# EAGLE board qo-100-lnb-controller (EAGLE 9.6.1)
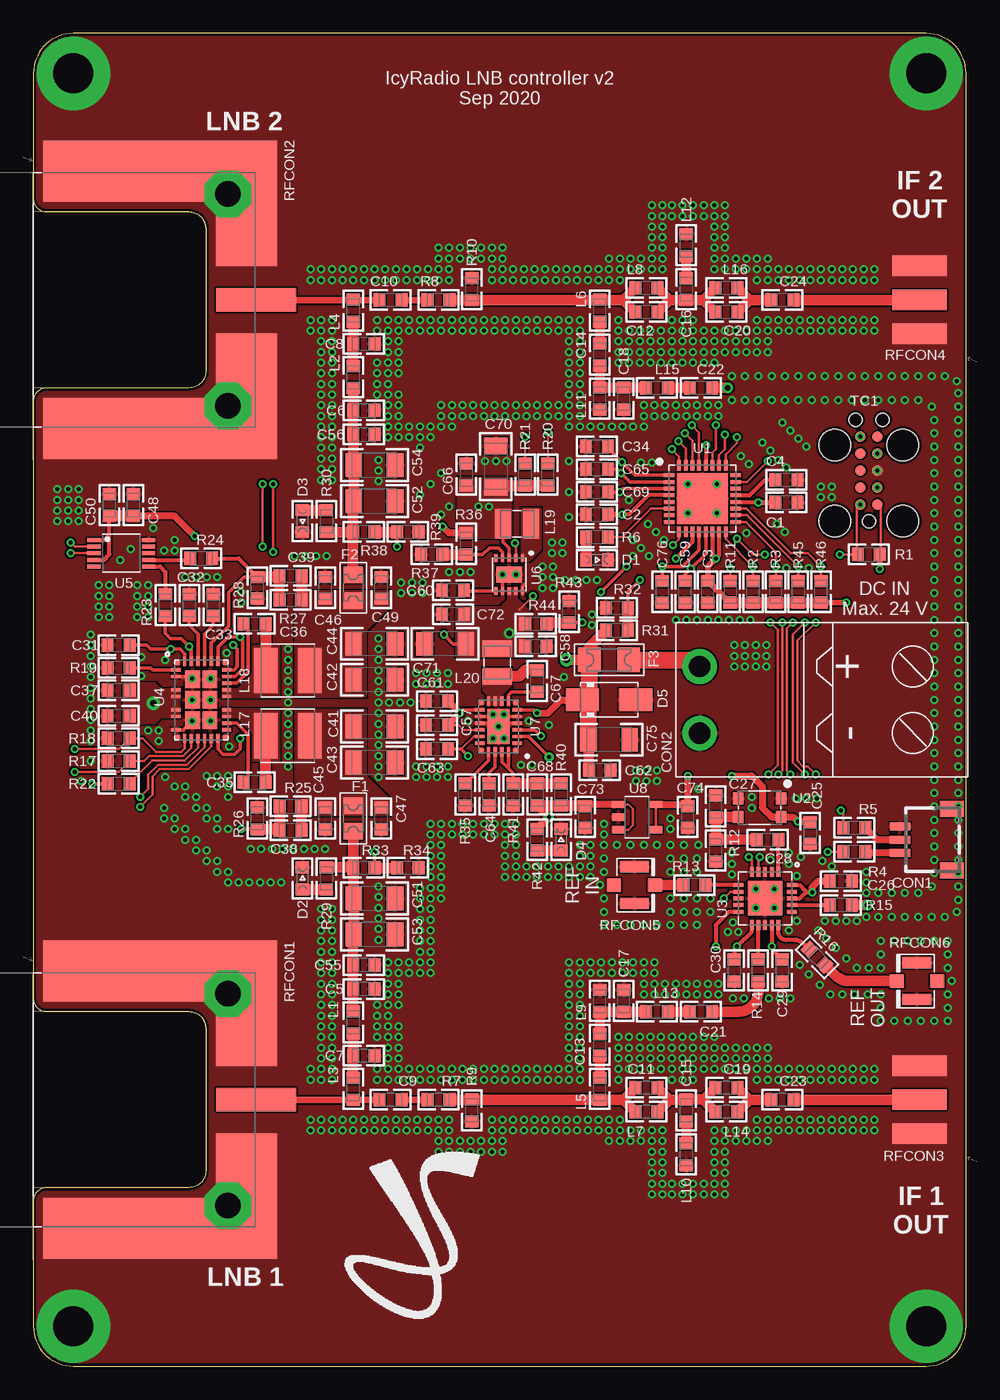
[diagram p10: board, top side]
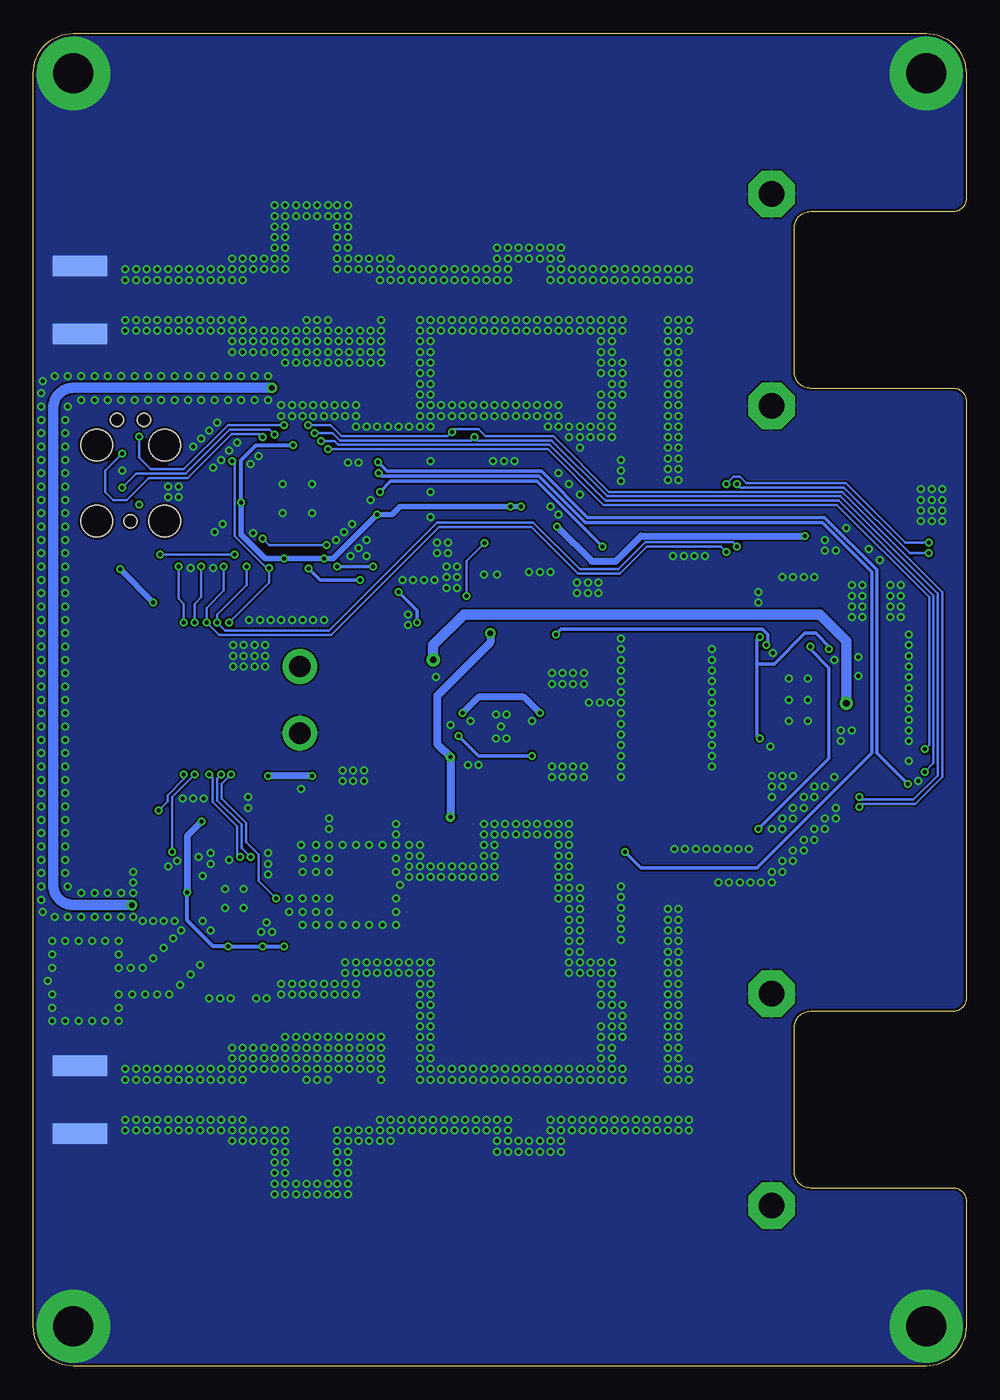
[diagram p11: board, bottom side, seen from below]

Size 70 x 100 mm. Coordinates in mm from the lower left corner, seen from the top.
Outline: 11.68,13.39 1,13.39 arc90 0,12.39 0,3 arc90 3,0 67,0 arc90 70,3 70,97 arc90 67,100 3,100 arc90 0,97 0,87.61 arc90 1,86.61 11.68,86.61 arc-90 12.95,85.33 12.95,74.67 arc-90 11.68,73.39 1,73.39 arc90 0,72.39 0,27.61 arc90 1,26.61 11.68,26.61 arc-90 12.95,25.34 12.95,14.66 arc-90 11.68,13.39
Copper layers (1*16): Top 0.035mm / dielectric 1.6mm / Bottom 0.035mm
Design rules "jlcpcb_2layer": minimum track width 5mil, minimum drill 0.3mm, track to track 5mil, track to pad 5mil, pad to pad 5mil, via to via 5mil, smd to smd 5mil, copper to edge 0.2mm, drill to drill 5mil, minimum pad ring 3mil, minimum via ring 3mil, stop-mask expansion 0.075mm, vias tented up to drill 10mm, thermal gap 5mil
Net classes: 1 75 Ohm: width 0.5 mm, clearance 0.3 mm

## Footprints (pad centres in the part's own frame; a part is rotated, then mirrored left to right if it is on the bottom)
CAP0603 = smd 0.889 x 1.016: 1 -0.819,0; 2 0.819,0
CAP1206 = smd 1.27 x 1.778: 1 -1.549,0; 2 1.549,0
SH-03-SIDE = smd 0.6 x 1.55: 1 -1,2.975; 2 0,2.975; 3 1,2.975 | smd 1.2 x 1.8: FIT@1 -2.3,-0.9; FIT@2 2.3,-0.9
2EDG-2P-5MM = drill 1.6 pad 2.6: P$1 -2.5,0; P$2 2.5,0
0603 = smd 0.889 x 1.016: A 0.819,0; C -0.819,0
DO214AC = smd 2.5 x 1.7: A 2,0; C -2,0
0805 = smd 1.245 x 1.473: 1 -0.965,0; 2 0.965,0
1206 = smd 1.7 x 1.803: 1 -1.472,0; 2 1.472,0
IND0603 = smd 0.889 x 1.016: 1 -0.819,0; 2 0.819,0
IND0404 = smd 1.75 x 3.4: 1 -1.65,0; 2 1.65,0
IND2520 = smd 2.2 x 1.2: 1 0,-1.05; 2 0,1.05
RES0603 = smd 0.889 x 1.016: 1 -0.819,0; 2 0.819,0
F-EDGE = smd 4.575 x 17.53: GND@0 -9.652,9.525; GND@5 9.652,9.525 | drill 1.91 pad 3.5 octagon: GND@1 -7.94,14.61; GND@4 7.94,14.61 | smd 9.4 x 4.58: GND@2 -7.24,16; GND@3 7.24,16 | smd 1.78 x 6: SIGNAL 0,16.71
SMA-EDGE = smd 1.524 x 4.064: GND@0 -2.54,0; GND@1 2.54,0; SIG 0,0 | smd 1.524 x 4.064 bottom: GND@2 -2.54,0; GND@3 2.54,0
U.FL = smd 2.2 x 0.85: P$1 0,1.375; P$2 0,-1.375 | smd 1.05 x 1: P$3 1.525,0; P$4 -1.525,0
TC2050-IDC = smd 0.787 x 0.787: 1 -2.54,-0.635; 2 -1.27,-0.635; 3 0,-0.635; 4 1.27,-0.635; 5 2.54,-0.635; 6 2.54,0.635; 7 1.27,0.635; 8 0,0.635; 9 -1.27,0.635; 10 -2.54,0.635 | hole 0.991: -3.81,0; 3.81,1.016; 3.81,-1.016 | hole 2.375: -3.81,2.54; -3.81,-2.54; 1.905,2.54; 1.905,-2.54
QFN32_0.5P_TG = smd 0.8 x 0.3: 1 -2.5,1.75; 2 -2.5,1.25; 3 -2.5,0.75; 4 -2.5,0.25; 5 -2.5,-0.25; 6 -2.5,-0.75; 7 -2.5,-1.25; 8 -2.5,-1.75; 17 2.5,-1.75; 18 2.5,-1.25; 19 2.5,-0.75; 20 2.5,-0.25; 21 2.5,0.25; 22 2.5,0.75; 23 2.5,1.25; 24 2.5,1.75 | smd 0.3 x 0.8: 9 -1.75,-2.5; 10 -1.25,-2.5; 11 -0.75,-2.5; 12 -0.25,-2.5; 13 0.25,-2.5; 14 0.75,-2.5; 15 1.25,-2.5; 16 1.75,-2.5; 25 1.75,2.5; 26 1.25,2.5; 27 0.75,2.5; 28 0.25,2.5; 29 -0.25,2.5; 30 -0.75,2.5; 31 -1.25,2.5; 32 -1.75,2.5 | smd 3.8 x 3.8: 33 0,0
TCXO-3225 = smd 0.78 x 0.9: 1 -1.6,-0.7; 2 1.6,-0.7; 3 1.6,0.7; 4 -1.6,0.7
QFN20 = smd 0.75 x 0.3: 1 -2,1; 2 -2,0.5; 3 -2,0; 4 -2,-0.5; 5 -2,-1; 11 2,-1; 12 2,-0.5; 13 2,0; 14 2,0.5; 15 2,1 | smd 0.3 x 0.75: 6 -1,-2; 7 -0.5,-2; 8 0,-2; 9 0.5,-2; 10 1,-2; 16 1,2; 17 0.5,2; 18 0,2; 19 -0.5,2; 20 -1,2 | smd 2.6 x 2.6: 21 0,0
QFN28_ASYM_CORNER = smd 0.7 x 0.25: 1 -1.9,2.25; 2 -1.9,1.75; 3 -1.9,0.75; 4 -1.9,0.25; 5 -1.9,-0.75; 6 -1.9,-1.25; 7 -1.9,-2.25; 14 1.9,-2.25; 15 1.9,-1.75; 16 1.9,-1.25; 17 1.9,-0.75; 18 1.9,0.25; 19 1.9,0.75; 20 1.9,1.25; 21 1.9,1.75; 22 1.9,2.25 | smd 0.25 x 0.7: 8 -1.25,-2.9; 9 -0.75,-2.9; 10 -0.25,-2.9; 11 0.25,-2.9; 12 0.75,-2.9; 13 1.25,-2.9; 23 1.25,2.9; 24 0.75,2.9; 25 0.25,2.9; 26 -0.25,2.9; 27 -0.75,2.9; 28 -1.25,2.9 | smd 0.375 x 0.375: 29 -1.812,2.812; 30 1.812,2.812; 31 1.812,-2.812; 32 -1.812,-2.812 | smd 1.1 x 1.33: 33 -0.65,1.53; 34 0.65,1.53; 35 -0.65,0; 36 0.65,0; 37 -0.65,-1.53; 38 0.65,-1.53
MSOP10 = smd 0.3 x 1: 1 -1,-2.05; 2 -0.5,-2.05; 3 0,-2.05; 4 0.5,-2.05; 5 1,-2.05; 6 1,2.05; 7 0.5,2.05; 8 0,2.05; 9 -0.5,2.05; 10 -1,2.05
DFN10 = smd 0.6 x 0.25: 1 -1.25,1; 2 -1.25,0.5; 3 -1.25,0; 4 -1.25,-0.5; 5 -1.25,-1; 6 1.25,-1; 7 1.25,-0.5; 8 1.25,0; 9 1.25,0.5; 10 1.25,1 | smd 1.2 x 1.9: 11 0,0
QFN20_ASYM_CORNER = smd 0.7 x 0.25: 1 -1.4,1.25; 2 -1.4,0.75; 3 -1.4,0.25; 4 -1.4,-0.25; 5 -1.4,-0.75; 6 -1.4,-1.25; 11 1.4,-1.25; 12 1.4,-0.75; 13 1.4,-0.25; 14 1.4,0.25; 15 1.4,0.75; 16 1.4,1.25 | smd 0.25 x 0.7: 7 -0.75,-1.9; 8 -0.25,-1.9; 9 0.25,-1.9; 10 0.75,-1.9; 17 0.75,1.9; 18 0.25,1.9; 19 -0.25,1.9; 20 -0.75,1.9 | smd 1.65 x 2.65: 21 0,0 | smd 0.375 x 0.375: M1 -1.312,1.812; M2 1.312,1.812; M3 -1.312,-1.812; M4 1.312,-1.812
SOT23-5 = smd 1 x 0.55: 1 -1.4,0.95; 2 -1.4,0; 3 -1.4,-0.95; 4 1.4,-0.95; 5 1.4,0.95

## Placement (x,y rotation side)
C1  100nF  [CAP0603]  56.5,64.8 0 top
C2  100nF  [CAP0603]  42.3,63.9 180 top
C3  100nF  [CAP0603]  50.6,58.1 270 top
C4  1uF  [CAP0603]  56.5,66.5 0 top
C5  100nF  [CAP0603]  24.8,28.3 0 top
C6  100nF  [CAP0603]  24.8,71.7 0 top
C7  150pF  [CAP0603]  24.8,23.3 0 top
C8  150pF  [CAP0603]  24.8,76.7 0 top
C9  100nF  [CAP0603]  26.8,20 0 top
C10  100nF  [CAP0603]  26.8,80 0 top
C11  330pF  [CAP0603]  46,20.9 0 top
C12  330pF  [CAP0603]  46,79.1 0 top
C13  100pF  [CAP0603]  42.5,24.1 90 top
C14  100pF  [CAP0603]  42.5,75.9 270 top
C15  100pF  [CAP0603]  49,19.2 270 top
C16  100pF  [CAP0603]  49,80.8 90 top
C17  1nF  [CAP0603]  44.3,27.4 90 top
C18  1nF  [CAP0603]  44.3,72.6 270 top
C19  330pF  [CAP0603]  52,20.9 0 top
C20  330pF  [CAP0603]  52,79.1 0 top
C21  100pF  [CAP0603]  50.1,26.6 0 top
C22  100pF  [CAP0603]  50.1,73.4 0 top
C23  68pF  [CAP0603]  56.2,20 0 top
C24  68pF  [CAP0603]  56.2,80 0 top
C25  100nF  [CAP0603]  58.3,40 270 top
C26  100nF  [CAP0603]  60.6,36.4 0 top
C27  10pF  [CAP0603]  51.2,42 90 top
C28  10pF  [CAP0603]  55.1,39.5 0 top
C29  100nF  [CAP0603]  56.2,29.7 270 top
C30  100nF  [CAP0603]  52.6,29.7 270 top
C31  1uF  [CAP0603]  6.4,54.1 180 top
C32  10nF  [CAP0603]  11.7,57.1 90 top
C33  10nF  [CAP0603]  13.5,57.1 90 top
C34  470pF  [CAP0603]  42.3,69 180 top
C35  100nF  [CAP0603]  16.6,43.8 180 top
C36  100nF  [CAP0603]  16.6,55.7 180 top
C37  4.7uF  [CAP0603]  6.4,50.7 180 top
C38  4.7pF  [CAP0603]  19.3,40.2 180 top
C39  4.7pF  [CAP0603]  19.3,59.3 180 top
C40  1uF  [CAP0603]  6.4,48.8 180 top
C41  22uF  [CAP1206]  25.6,48 0 top
C42  22uF  [CAP1206]  25.6,51.5 0 top
C43  22uF  [CAP1206]  25.6,45.3 0 top
C44  22uF  [CAP1206]  25.6,54.2 0 top
C45  100nF  [CAP0603]  21.9,41.1 270 top
C46  100nF  [CAP0603]  21.9,58.4 90 top
C47  100nF  [CAP0603]  26.1,41.1 270 top
C48  10uF  [CAP0603]  7.5,64.6 90 top
C49  100nF  [CAP0603]  26.1,58.4 90 top
C50  100nF  [CAP0603]  5.7,64.6 90 top
C51  22uF  [CAP1206]  25.6,35.1 0 top
C52  22uF  [CAP1206]  25.6,64.9 0 top
C53  22uF  [CAP1206]  25.6,32.4 0 top
C54  22uF  [CAP1206]  25.6,67.6 0 top
C55  100nF  [CAP0603]  24.8,30.1 0 top
C56  100nF  [CAP0603]  24.8,69.9 0 top
C57  4.7uF  [CAP0603]  30.3,48.1 180 top
C58  4.7uF  [CAP0603]  37.7,54 0 top
C59  470pF  [CAP0603]  48.9,58.1 270 top
C60  470pF  [CAP0603]  31.5,58.2 180 top
C61  1uF  [CAP0603]  30.3,49.9 180 top
C62  1uF  [CAP0603]  42.5,44.7 0 top
C63  1uF  [CAP0603]  30.3,46.3 180 top
C64  10nF  [CAP0603]  34.2,42.9 270 top
C65  470pF  [CAP0603]  42.3,67.3 180 top
C66  100nF  [CAP0603]  32.5,66.9 90 top
C67  100nF  [CAP0603]  37.8,51.4 270 top
C68  10pF  [CAP0603]  37.8,42.9 90 top
C69  470pF  [CAP0603]  42.3,65.6 180 top
C70  100uF  [CAP1206]  34.7,67.5 90 top
C71  100uF  [CAP1206]  30.9,54.2 180 top
C72  100nF  [CAP0603]  31.5,56.4 180 top
C73  1uF  [CAP0603]  41.4,41.2 270 top
C74  10uF  [CAP0603]  49.1,41.2 270 top
C75  10uF  [CAP1206]  43.2,47 0 top
C76  470pF  [CAP0603]  47.2,58.1 270 top
CON1  3P-SH-SIDE  [SH-03-SIDE]  68,39.5 90 top
CON2  2EDG-2P-5MM  [2EDG-2P-5MM]  50,50 90 top
D1  LED0603  [0603]  42.3,60.5 180 top
D2  LED0603  [0603]  20.2,36.6 270 top
D3  LED0603  [0603]  20.2,63.4 90 top
D4  LED0603  [0603]  39.6,39.5 270 top
D5  SMAJ24A  [DO214AC]  43.2,50 0 top
F1  [0805]  24,41.1 90 top
F2  [0805]  24,58.4 270 top
F3  2.6A Hold  [1206]  43.2,53 0 top
L1  470nH  [IND0603]  24,25.8 270 top
L2  470nH  [IND0603]  24,74.2 90 top
L3  470nH  [IND0603]  24,20.8 270 top
L4  470nH  [IND0603]  24,79.2 90 top
L5  470nH  [IND0603]  42.5,20.8 90 top
L6  470nH  [IND0603]  42.5,79.2 270 top
L7  120nH  [IND0603]  46,19.1 0 top
L8  120nH  [IND0603]  46,80.9 0 top
L9  43nH  [IND0603]  42.5,27.4 90 top
L10  330nH  [IND0603]  49,15.9 90 top
L11  43nH  [IND0603]  42.5,72.6 270 top
L12  330nH  [IND0603]  49,84.1 270 top
L13  470nH  [IND0603]  46.8,26.6 0 top
L14  120nH  [IND0603]  52,19.1 0 top
L15  470nH  [IND0603]  46.8,73.4 0 top
L16  120nH  [IND0603]  52,80.9 0 top
L17  4.7uH  [IND0404]  19.1,47.3 0 top
L18  4.7uH  [IND0404]  19.1,52.2 0 top
L19  2.2uH  [IND2520]  36.3,63.2 90 top
L20  4.7uH  [IND2520]  34.8,52.8 0 top
LOGO1  JS-10MM  [JS_10MM]  34.4,16.6 0 top
R1  10K Ohms  [RES0603]  62.7,60.9 0 top
R2  1K Ohms  [RES0603]  54,58.1 270 top
R3  1K Ohms  [RES0603]  55.7,58.1 270 top
R4  100 Ohms  [RES0603]  61.6,38.6 180 top
R5  100 Ohms  [RES0603]  61.6,40.4 180 top
R6  330 Ohms  [RES0603]  42.3,62.2 0 top
R7  43.2 Ohms  [RES0603]  30.4,20 180 top
R8  43.2 Ohms  [RES0603]  30.4,80 180 top
R9  86.6 Ohms  [RES0603]  32.9,19.2 90 top
R10  86.6 Ohms  [RES0603]  32.9,80.8 270 top
R11  100K Ohms  [RES0603]  52.3,58.1 270 top
R12  10K Ohms  [RES0603]  51.2,38.7 90 top
R13  0 Ohms  [RES0603]  49.6,36.1 180 top
R14  0 Ohms  [RES0603]  54.4,29.7 90 top
R15  0 Ohms  [RES0603]  60.6,34.6 180 top
R16  0 Ohms  [RES0603]  58.8,30.7 135 top
R17  100K Ohms  [RES0603]  6.4,45.4 0 top
R18  100K Ohms  [RES0603]  6.4,47.1 0 top
R19  15K Ohms  [RES0603]  6.4,52.4 0 top
R20  100K Ohms  [RES0603]  38.6,66.9 270 top
R21  100K Ohms  [RES0603]  36.9,66.9 270 top
R22  1K Ohms  [RES0603]  6.4,43.7 0 top
R23  191K Ohms  [RES0603]  9.9,57.1 90 top
R24  191K Ohms  [RES0603]  12.6,60.6 180 top
R25  1M Ohms  [RES0603]  19.3,42 0 top
R26  51K Ohms  [RES0603]  16.8,41.1 270 top
R27  1M Ohms  [RES0603]  19.3,57.5 0 top
R28  51K Ohms  [RES0603]  16.8,58.4 90 top
R29  2.55K Ohms  [RES0603]  22,36.6 90 top
R30  2.55K Ohms  [RES0603]  22,63.4 270 top
R31  100K Ohms  [RES0603]  43.8,55.2 180 top
R32  10K Ohms  [RES0603]  43.8,56.9 0 top
R33  90.9K Ohms  [RES0603]  24.8,37.4 180 top
R34  12K Ohms  [RES0603]  28.1,37.4 180 top
R35  41.2K Ohms  [RES0603]  32.4,42.9 90 top
R36  309K Ohms  [RES0603]  32.5,61.7 90 top
R37  71.5K Ohms  [RES0603]  29.9,60.9 0 top
R38  90.9K Ohms  [RES0603]  24.8,62.6 180 top
R39  12K Ohms  [RES0603]  28.1,62.6 180 top
R40  1M Ohms  [RES0603]  39.6,42.9 270 top
R41  226K Ohms  [RES0603]  36,42.9 90 top
R42  510 Ohms  [RES0603]  37.8,39.5 90 top
R43  75K Ohms  [RES0603]  40.2,56.6 270 top
R44  100K Ohms  [RES0603]  37.7,55.7 180 top
R45  47K Ohms  [RES0603]  57.4,58.1 270 top
R46  47K Ohms  [RES0603]  59.1,58.1 270 top
RFCON1  RFCON-F-EDGE  [F-EDGE]  0,20 270 top
RFCON2  RFCON-F-EDGE  [F-EDGE]  0,80 270 top
RFCON3  RFCON-SMA-EDGE  [SMA-EDGE]  66.5,20 90 top
RFCON4  RFCON-SMA-EDGE  [SMA-EDGE]  66.5,80 90 top
RFCON5  RFCON-U.FL  [U.FL]  45.1,36.1 0 top
RFCON6  RFCON-U.FL  [U.FL]  66.3,28.9 180 top
TC1  TC2050-IDC  [TC2050-IDC]  62.7,67.2 90 top
U1  EFM32TG11B120F128GM32  [QFN32_0.5P_TG]  50.2,65.1 0 top
U2  DSB321SDA  [TCXO-3225]  54.5,41.9 180 top
U3  SI5351C-B-GM  [QFN20]  54.9,35.1 270 top
U4  LT8650S-1  [QFN28_ASYM_CORNER]  12.6,50 0 top
U5  MCP4728-A2  [MSOP10]  6.6,61 270 top
U6  MIC23155  [DFN10]  35.7,59.4 270 top
U7  LT8636  [QFN20_ASYM_CORNER]  34.9,48 180 top
U8  ADP7142AUJZ-3.3  [SOT23-5]  45.3,41.2 0 top

## Tracks (layer width: path | path; a pad name or v marks a point on that pad's centre or on a via)
3V3  (via drill 0.3)
  Top 0.2: R1.2 63.6,60.98 63.6,64.39 TC1.1
  Top 0.254: U6.3 35.7,61.4 35.25,61.85 L19.2
  Top 0.305: 52.32,57.3 R11.2 | U5.1 5.3,62 5.7,62.4 | 5.7,62.4 C50.1 | U5.4 5.3,60.5 5.7,60.9 5.7,62.4 | U1.4 46.15,65.35 44.7,63.9 v44.2,63.9 | v50.5,69.1 50.45,69.05 U1.28 | U1.20 54.35,64.85 v54.4,64.8 | U1.14 50.95,60.85 v51.2,60.6 51.45,60.85 U1.15 | U1.11 49.45,61.85 v48.2,60.6
  Top 0.406: C2.1 v44.2,63.9 | C1.1 v54.4,64.8 | v51.2,60.6 50.6,60 C3.1 52.24,57.28 R11.2 | 53.94,57.28 R2.2 | v61,57.3 60.98,57.28 R46.2 | v63.5,59.8 63.52,59.82 R1.2
  Top 0.508: R36.2 31.18,62.52 v30.7,63 | v12.1,62.3 10.62,63.78 C48.1
  Top 0.813: C48.1 C50.1 | R46.2 R45.2 R3.2 R2.2 | R11.2 53.94,57.28 | C70.1 34.83,66.08 R21.2 R20.2
  Bottom 0.305: v54.4,64.8 54.4,68 53.3,69.1 v50.5,69.1
  Bottom 0.406: v33.4,64.5 42.5,64.5 43.1,63.9 v44.2,63.9 47.5,60.6 v48.2,60.6 v51.2,60.6 52.6,60.6 54.4,62.4 v54.4,64.8 | v63.5,59.8 v61,57.3
  Bottom 0.508: v30.7,63 28.1,60.4 26.3,60.4 24.4,62.3 v12.1,62.3
  other vias: 34.2,64.5
  pour Top (no thermals): 35.8,62.2 31.9,62.2 31.9,66.6 35.8,66.6
3V3_FB
  Top 0.254: U6.4 35.2,61.1 34.9,61.4 34.22,61.4 33.7,60.88 R36.1
  Top 0.813: R37.2 30.74,60.88 R36.1
3V3_REF_CLEAN  (via drill 0.3)
  Top 0.2: U8.4 U8.5
  Top 0.305: C30.1 52.6,31.3 v52.8,31.5 53.9,32.6 U3.11 | C29.1 55.4,31.32 v55.4,31.5 U3.14 | 59.48,36.1 C26.1 | U3.20 57.5,36.1 58.05,35.55 v58.45,35.55 57.97,35.55 57.52,35.1 U3.18 | U3.10 52.2,34.1 51.2,33.1 v51.2,31.5
  Top 0.508: U8.5 48.97,42.15 C74.1 v49.1,44.3 | C25.1 58.26,40.86 v57.36,40.86 57.02,41.2 U2.4 55.4,41.2 54.7,41.9 54.7,43.5 53.9,44.3 v52.4,44.3 | v58.45,35.55 58.45,35.95 58.9,36.4 C26.1
  Bottom 0.305: v51.2,31.5 v52.8,31.5 v55.4,31.5 56.5,31.5 58.45,33.45 v58.45,35.55
  Bottom 0.508: v57.36,40.86 58.45,39.77 v58.45,35.55 | v49.1,44.3 v52.4,44.3
3V3_SOFTSTART
  Top 0.254: U6.6 32.37,58.15 C60.1
3V3_SW
  pour Top (no thermals): 36.7,60.48 36.7,64.3 38,64.3 38,61.3 37.18,60.48
5V0  (via drill 0.3, 0.3 pad 0.7, 0.4 pad 0.7)
  Top 0.2: U8.3 44.65,40.25 45,40.6 45,41.8 44.65,42.15 U8.1 | U6.2 36.2,61.7 v36.13,61.77 | v37.5,57.8 36.48,56.78
  Top 0.254: U7.2 37.15,47.25 v38.7,45.7 | U4.22 15.05,52.25 15.3,52.5 15.3,53.8 v15,54.1 | v30.8,54.9 31.5,54.2 C71.1
  Top 0.508: U8.1 41.53,42.15 C73.1
  Top 0.61: 38.68,41.2 C68.1 | R42.2 38.68,41.2 | 38.68,41.2 v38.7,41.2
  Top 0.813: C68.1 R40.2 41.34,42.08 C73.1
  Bottom 0.2: v36.13,61.77 37.5,60.4 v37.5,57.8
  Bottom 0.254: v15,54.1 14.9,54.2 14.9,54.9 15.3,55.3 30.4,55.3 v30.8,54.9
  Bottom 0.61: v35.7,55 35.7,54.3 39.7,50.3 39.7,46.7 v38.7,45.7 v38.7,41.2
  pour Top (no thermals): 31.8,53.3 37.3,53.3 37.3,56.5 36.2,57.6 36.2,58.32 35.7,58.32 35.7,57.5 35.1,56.9 31.8,56.9
5V0_BST
  Top 0.254: U7.7 35.65,50.35 35.88,50.58 C67.2
5V0_FB
  Top 0.254: R41.2 36,44.5 35.65,44.85 | U7.19 35.15,45.35 35.65,44.85 | U7.20 35.65,44.85
  Top 0.813: R41.2 C68.2 R40.1
5V0_INTVCC  (via drill 0.3)
  Top 0.2: U7.15 33.05,47.25 32.1,46.3
  Top 0.254: U7.3 37.65,47.75 v38.1,47.3 | v32.6,45.8 32.1,46.3 C63.1
  Bottom 0.254: v38.1,47.3 36.6,45.8 v32.6,45.8
5V0_RT
  Top 0.254: U7.17 34.15,45.45 32.42,43.72 R35.2
5V0_SS
  Top 0.254: U7.18 34.65,44.95 34.2,44.5 C64.1
5V0_SW
  Top 0.813: C67.1 36.92,52.22 36.45,51.75 L20.1
  pour Top (no thermals): 34.15,49.68 35.15,49.68 35.15,50.45 35.8,51.1 35.8,52.3 33.8,52.3 33.8,50.7 34.15,50.35
5V0_VSENSE  (via drill 0.3)
  Top 0.254: R43.2 41.18,55.78 v41.2,55.8 | v44.5,60 v42.6,58.1 | v47.2,60 C76.1 | 47.3,59.9 v47.2,60 | U1.12 49.95,61.25 48.7,60 v47.2,60
  Top 0.813: R44.1 38.6,55.78 R43.2
  Bottom 0.254: v41.2,55.8 41.2,56.7 v42.6,58.1 | v47.2,60 v44.5,60
!REF_SYNTH_OE  (via drill 0.3)
  Top 0.2: v51.8,35.1 52.3,35.6 U3.7 | v55.17,44.4 55.37,44.6 55.37,44.62 55.87,45.12 55.87,55.23 v55.3,55.8 | v52.3,59.9 R11.1 | v55.1,67.9 53.55,66.35 U1.23
  Bottom 0.2: v51.8,35.1 53.1,36.4 53.1,38.4 54.05,39.35 54.05,40.77 55.87,42.6 55.87,43.68 55.37,44.18 55.37,44.2 v55.17,44.4 | v55.3,55.8 52.3,58.8 v52.3,59.9 52.51,59.9 54.9,62.29 54.9,67.7 v55.1,67.9
!RESET  (via drill 0.3)
  Top 0.2: v62.06,64.66 61.8,64.39 61.8,60.98 R1.1 v60.5,60.9 | U1.9 48.45,62.05 v48,61.6 | v52.8,62.1 54,60.9 v54.9,60.9
  Bottom 0.2: v60.5,60.9 v54.9,60.9 | v52.8,62.1 52.3,61.6 v48,61.6
BIAS_REG_TEMP  (via drill 0.3)
  Top 0.254: C34.1 43.12,68.88 v44.15,67.85 45.15,66.85 U1.1 | v4.4,43.7 R22.1
  Bottom 0.254: v44.15,67.85 43.46,67.16 31.88,67.16 28.4,63.68 10.64,63.68 6.72,59.76 6.72,46.02 v4.4,43.7
EXT_REF_IN
  Top 0.8: RFCON5.P$3 R13.2
EXT_REF_OUT
  Top 0.8: R16.1 60.16,29.34 arc45 61.22,28.9 RFCON6.P$3
GND  (via drill 0.3, 3 pad 5.5)
  Top 0.254: U4.7 11.25,47.75 v11.9,48.4 | U4.2 11.75,51.75 v11.9,51.6 | U6.7 35.2,58.9 U6.11 | U6.10 36.7,58.5 36.9,58.7 | U7.13 34.65,48.25 U7.21 | U7.12 34.15,48.75 U7.21 | U7.4 35.15,48.25 U7.21 | U7.5 35.65,48.75 U7.21 | 49.2,64.1 v49.1,64
  Top 0.406: U3.21 v54.2,34.4 | U3.21 v55.6,34.4 | U3.21 v55.6,35.8 | U3.21 v54.2,35.8
  Top 0.813: U1.33 v49.1,66.2 | U1.33 v51.3,66.2 | U1.33 v51.3,64 | U1.33 49.2,64.1
  other vias: 3,3 3,97 67,97 67,3 14.5,53.5 14.7,46.5 13.3,48.4 13.3,50 11.9,50 13.3,51.6 69.4,72 69.4,61 69.4,62 69.4,63 69.4,64 69.4,65 69.4,66 69.4,67 69.4,68 69.4,69 69.4,70 69.4,71 69.4,36 69.3,34.1 68.4,33.7 67.4,33.7 66.4,33.7 65.4,33.7 64.4,33.7 63.4,33.7 69.4,35 67.6,37 67.4,36 66.4,35.5 65.4,35.5 64.4,35.5 63.4,35.5 69.4,48 69.4,37 69.4,38 69.4,39 69.4,40 69.4,41 69.4,42 69.4,43 69.4,44 69.4,45 69.4,46 69.4,47 69.4,60 69.4,49 69.4,50 69.4,51 69.4,52 69.4,53 69.4,54 69.4,55 69.4,56 69.4,57 69.4,58 69.4,59 67.6,62 67.6,63 67.6,64 67.6,65 67.6,66 67.6,67 67.6,68 67.6,69 67.6,70 67.6,71 67.6,49 67.6,38 67.6,39 67.6,40 67.6,41 67.6,42 67.6,43 67.6,44 67.6,45 67.6,46 67.6,47 67.6,48 67.6,61 67.6,50 67.6,51 67.6,52 67.6,53 67.6,54 67.6,55 67.6,56 67.6,57 67.6,58 67.6,59 67.6,60 69.3,73.9 69.4,73 67.4,72 59.4,72.5 66.4,72.5 65.4,72.5 64.4,72.5 63.4,72.5 62.4,72.5 61.4,72.5 60.4,72.5 59.4,74.3 66.4,74.3 65.4,74.3 64.4,74.3 63.4,74.3 62.4,74.3 61.4,74.3 60.4,74.3 67.4,74.3 68.4,74.3 58.4,72.5 57.4,72.5 56.4,72.5 55.4,72.5 54.4,72.5 53.4,72.5 52.4,72.5 58.4,74.3 57.4,74.3 56.4,74.3 55.4,74.3 54.4,74.3 53.4,74.3 52.4,74.3 58.9,32.7 35.3,48.9 34.5,48.9 35.3,47.1 34.5,47.1 34.9,48 32.6,48.4 37.2,48.4 38.2,58.4 38.2,59.2 38.2,60 36.2,59.4 35.2,59.4 53.1,68.3 53.7,67.7 49.8,33.1 52.9,32.6 52.5,33.3 52.1,32.6 59.4,33.4 57.3,33.4 56.7,32.7 55.3,38 56.7,37.7 56.7,38.5 52.4,38.5 52.4,37.7 52.4,36.9 57.3,36.8 53.9,42.7 53.9,41.9 49.9,43.3 49.8,37.1 49.8,38.1 48.8,39.1 48.8,38.1 47.8,40.3 49.9,39.1 48.8,34.1 48.8,33.1 48.8,35.1 49.8,34.1 50.8,35.1 48.8,37.1 49.8,35.1 59.2,37.9 57.6,38.2 62.5,37.1 62.5,36.3 61,33.4 60.2,33.4 63.6,29.9 62.7,29.9 59.5,32.1 60.2,31.4 61.8,29.9 61,30.6 63.6,27.9 62.6,27.9 61.6,27.9 60.7,27.9 57.5,30.1 58.2,29.4 59.8,27.9 59,28.6 53.3,27.6 55.2,27.6 56,27.6 56.8,27.6 52.5,27.6 62.5,33.7 62.5,35.5 59.9,37.5 61.8,33.4 15.6,57.3 12.2,59.2 11.4,59.2 4.9,56.2 5.7,56.2 15.6,58.1 13.8,59.2 13,59.2 8.1,51.8 9.4,46.9 9.4,47.7 8.6,47.7 9.9,53 8.1,53.2 4.3,54.9 19.1,48.2 19.1,49 19.1,49.8 19.1,50.6 19.1,51.4 19.1,52.2 19.1,53 19.1,53.8 19.1,45 19.1,45.8 19.1,46.6 19.1,47.4 68.6,31.9 67.6,31.9 66.6,31.9 65.6,31.9 64.6,31.9 63.6,31.9 63.6,30.9 63.6,26.9 68.6,30.9 68.6,29.9 68.9,28.9 68.6,27.9 68.6,26.9 68.6,25.9 67.6,25.9 66.6,25.9 65.6,25.9 64.6,25.9 63.6,25.9 47.8,35.1 47.8,37.1 42.8,33.1 43.8,33.1 44.8,33.1 45.8,33.1 46.8,33.1 47.8,33.1 47.8,34.1 47.8,38.1 42.8,34.1 42.8,35.1 42.5,36.1 42.8,37.1 42.8,38.1 42.8,39.1 43.8,39.1 44.8,39.1 45.8,39.1 46.8,39.1 47.8,39.1 50.8,34.1 4.3,47.7 4.3,46.9 4.3,49.3 4.3,48.5 4.3,50.9 4.3,50.1 4.3,52.5 4.3,51.7 4.3,54.1 4.3,53.3 5.7,58.6 4.9,58.6 4.9,57.8 5.7,57.8 4.9,57 5.7,57 9.8,61.2 10.6,61.2 10.6,62 6.5,60.5 7.3,61.3 9,62.9 7.8,56.2 8.6,56.2 8.6,58.6 7.8,58.6 7.8,57.8 8.6,57.8 7.8,57 8.6,57 20.4,60.8 19.6,60.8 22,60.8 21.2,60.8 17.1,38.8 16.3,38.8 18.7,38.8 17.9,38.8 20.3,38.8 19.5,38.8 21.9,38.8 21.1,38.8 18.6,36.3 17,36.3 16.2,36.3 17.8,36.3 15.4,36.3 14.6,36.3 14.6,37.1 13.8,37.1 13.8,37.9 13,37.9 13,38.7 12.2,38.7 12.2,39.5 11.4,39.5 11.4,40.3 10.6,40.3 10.6,41.1 9.8,41.1 9.8,41.9 14.6,40.3 13.8,40.3 13,41.1 13.8,41.1 13,41.9 12.2,41.9 12.2,42.7 14.6,42.7 11.4,43.5 10.6,43.5 11.4,42.7 9.9,44.2 13,44.3 14.6,44.3 13.8,44.3 14.6,43.5 13.8,43.5 4.3,45.4 3.6,43.9 63.34,67.2 53.5,62.5 55.8,63.2 56.4,62.6 55.9,68 56.5,67.4 54.7,69.3 55.3,68.7 57.4,69.6 58,69 56.2,70.8 56.8,70.2 45.6,61.4 46.2,60.8 45,60.8 45,62 42.3,59 46.7,62.6 47.3,62 46.1,63.2 40.2,70.5 41,70.5 41.8,70.5 42.6,70.5 43.4,70.5 44.2,70.5 45,70.5 45.8,70.5 46.4,67.8 45.6,67.8 44.7,65 41.9,55.6 41.9,56.4 41.5,59 40.7,59 39.9,59 53.8,56 53,56 52.2,56 51.4,56 50.6,56 49.8,56 49,56 48.2,56 55,52.5 54.2,52.5 53.4,52.5 52.6,52.5 55,53.3 54.2,53.3 53.4,53.3 52.6,53.3 55,54.1 54.2,54.1 53.4,54.1 52.6,54.1 58.2,59.9 56.5,59.9 20.8,81.5 21.6,81.5 22.4,81.5 23.2,81.5 24,81.5 24.8,81.5 25.6,81.5 26.4,81.5 24,82.3 24.8,82.3 25.6,82.3 26.4,82.3 20.8,82.3 21.6,82.3 22.4,82.3 23.2,82.3 27.2,82.3 28,82.3 28.8,82.3 29.6,82.3 30.4,82.3 31.2,82.3 30.4,83.9 31.2,83.9 30.4,81.5 31.2,81.5 30.4,83.1 31.2,83.1 32,83.1 32.8,83.1 33.6,83.1 34.4,83.1 27.2,81.5 28,81.5 28.8,81.5 29.6,81.5 32,83.9 32.8,83.9 33.6,83.9 34.4,83.9 35.2,83.1 34.4,81.5 35.2,81.5 36,81.5 35.2,83.9 34.4,82.3 35.2,82.3 36,82.3 36.8,82.3 37.6,82.3 38.4,82.3 39.2,82.3 36.8,81.5 37.6,81.5 38.4,81.5 39.2,81.5 40,81.5 40.8,81.5 41.6,81.5 42.4,81.5 40,82.3 40.8,82.3 41.6,82.3 42.4,82.3 44.8,83.1 45.6,83.1 46.4,83.1 47.2,83.1 43.2,82.3 44,82.3 50.3,86.3 50.3,87.1 44.8,82.3 45.6,82.3 46.4,82.3 47.2,82.3 43.2,81.5 44,81.5 43.2,83.1 44,83.1 59.9,82.3 60.7,82.3 61.5,82.3 62.3,82.3 59.9,81.5 60.7,81.5 61.5,81.5 62.3,81.5 63.1,81.5 63.1,82.3 55.9,82.3 56.7,82.3 57.5,82.3 58.3,82.3 55.9,81.5 56.7,81.5 57.5,81.5 58.3,81.5 59.1,81.5 59.1,82.3 52.7,83.1 53.5,83.1 54.3,83.1 55.1,83.1 52.7,82.3 53.5,82.3 54.3,82.3 55.1,82.3 55.1,81.5 54.3,81.5 51.1,82.3 51.1,83.1 51.1,83.9 51.1,84.7 51.9,82.3 51.9,83.1 51.9,83.9 51.9,84.7 51.9,85.5 51.1,85.5 47.9,87.1 48.7,87.1 49.5,87.1 51.1,87.1 47.9,86.3 48.7,86.3 49.5,86.3 51.1,86.3 51.9,86.3 51.9,87.1 46.4,83.9 46.4,84.7 46.4,85.5 46.4,86.3 47.2,83.9 47.2,84.7 47.2,85.5 47.2,86.3 47.2,87.1 46.4,87.1 48.7,78.5 49.5,78.5 50.3,77.7 51.1,77.7 47.9,78.5 45.5,76.9 46.3,76.9 47.1,76.9 47.9,76.9 45.5,76.1 46.3,76.1 47.1,76.1 47.9,76.1 48.7,76.1 48.7,76.9 47.9,77.7 48.7,77.7 49.5,76.9 50.3,76.9 51.1,76.9 51.9,76.9 49.5,76.1 50.3,76.1 51.1,76.1 51.9,76.1 52.7,76.1 52.7,76.9 53.5,76.9 54.3,76.9 55.1,76.9 54.3,78.5 53.5,76.1 54.3,76.1 55.1,76.1 54.3,77.7 55.1,77.7 55.1,78.5 52.7,77.7 53.5,77.7 49.5,77.7 51.9,77.7 47.1,77.7 45.5,77.7 46.3,77.7 44.7,77.7 44.7,76.9 43.9,76.9 43.9,76.1 43.9,75.3 47.9,75.3 48.7,75.3 49.5,75.3 50.3,75.3 44.7,76.1 44.7,75.3 45.5,75.3 46.3,75.3 47.1,75.3 51.1,75.3 55.9,78.5 56.7,78.5 57.5,78.5 58.3,78.5 55.9,77.7 56.7,77.7 57.5,77.7 58.3,77.7 59.1,77.7 59.1,78.5 59.9,78.5 60.7,78.5 61.5,78.5 62.3,78.5 59.9,77.7 60.7,77.7 61.5,77.7 62.3,77.7 63.1,77.7 63.1,78.5 43.9,78.5 43.9,77.7 20.8,77.7 21.6,77.7 22.4,77.7 20.8,78.5 21.6,78.5 22.4,78.5 26.6,76.9 26.6,76.1 27.4,76.1 27.4,76.9 26.6,75.3 25.8,78.5 26.6,78.5 27.4,75.3 25.8,75.3 25.8,77.7 26.6,77.7 27.4,77.7 27.4,78.5 28.2,78.5 29,78.5 29.8,78.5 30.6,78.5 28.2,77.7 29,77.7 29.8,77.7 30.6,77.7 31.4,77.7 31.4,78.5 32.2,78.5 32.2,77.7 33,77.7 33,78.5 33.8,78.5 34.6,78.5 35.4,78.5 36.2,78.5 33.8,77.7 34.6,77.7 35.4,77.7 36.2,77.7 37,77.7 37,78.5 37.8,78.5 38.6,78.5 39.4,78.5 40.2,78.5 37.8,77.7 38.6,77.7 39.4,77.7 40.2,77.7 41,77.7 41,78.5 22.4,66.5 21.6,66.5 25.9,67.2 29.8,66.2 29,68.9 29,65.4 29.8,70.5 29.8,69.7 29,69.7 28.2,69.7 27.4,72.1 27.4,71.3 29,70.5 28.2,70.5 26.6,72.1 26.6,71.3 26.6,70.5 27.4,70.5 27.4,69.7 27.4,72.9 26.6,74.5 26.6,73.7 26.6,69.7 27.4,74.5 25.8,74.5 25.8,73.7 25.8,72.9 26.6,72.9 25.9,68 30.6,67 22.4,67.3 21.6,67.3 21.6,68.1 22.4,68.1 22.4,68.9 21.6,68.9 21.6,69.7 21.6,70.5 21.6,71.3 21.6,72.1 22.4,69.7 22.4,70.5 22.4,71.3 22.4,72.1 22.4,72.9 21.6,72.9 21.6,73.7 21.6,74.5 21.6,75.3 21.6,76.1 22.4,73.7 22.4,74.5 22.4,75.3 22.4,76.1 22.4,76.9 21.6,76.9 25.9,66.4 20.8,18.5 21.6,18.5 22.4,18.5 23.2,18.5 24,18.5 24.8,18.5 25.6,18.5 26.4,18.5 24,17.7 24.8,17.7 25.6,17.7 26.4,17.7 20.8,17.7 21.6,17.7 22.4,17.7 23.2,17.7 27.2,17.7 28,17.7 28.8,17.7 29.6,17.7 30.4,17.7 31.2,17.7 30.4,16.1 31.2,16.1 30.4,18.5 31.2,18.5 30.4,16.9 31.2,16.9 32,16.9 32.8,16.9 33.6,16.9 34.4,16.9 27.2,18.5 28,18.5 28.8,18.5 29.6,18.5 32,16.1 32.8,16.1 33.6,16.1 34.4,16.1 35.2,16.9 34.4,18.5 35.2,18.5 36,18.5 35.2,16.1 34.4,17.7 35.2,17.7 36,17.7 36.8,17.7 37.6,17.7 38.4,17.7 39.2,17.7 36.8,18.5 37.6,18.5 38.4,18.5 39.2,18.5 40,18.5 40.8,18.5 41.6,18.5 42.4,18.5 40,17.7 40.8,17.7 41.6,17.7 42.4,17.7 44.8,16.9 45.6,16.9 46.4,16.9 47.2,16.9 43.2,17.7 44,17.7 50.3,13.7 50.3,12.9 44.8,17.7 45.6,17.7 46.4,17.7 47.2,17.7 43.2,18.5 44,18.5 43.2,16.9 44,16.9 59.9,17.7 60.7,17.7 61.5,17.7 62.3,17.7 59.9,18.5 60.7,18.5 61.5,18.5 62.3,18.5 63.1,18.5 63.1,17.7 55.9,17.7 56.7,17.7 57.5,17.7 58.3,17.7 55.9,18.5 56.7,18.5 57.5,18.5 58.3,18.5 59.1,18.5 59.1,17.7 52.7,16.9 53.5,16.9 54.3,16.9 55.1,16.9 52.7,17.7 53.5,17.7 54.3,17.7 55.1,17.7 55.1,18.5 54.3,18.5 51.1,17.7 51.1,16.9 51.1,16.1 51.1,15.3 51.9,17.7 51.9,16.9 51.9,16.1 51.9,15.3 51.9,14.5 51.1,14.5 47.9,12.9 48.7,12.9 49.5,12.9 51.1,12.9 47.9,13.7 48.7,13.7 49.5,13.7 51.1,13.7 51.9,13.7 51.9,12.9 46.4,16.1 46.4,15.3 46.4,14.5 46.4,13.7 47.2,16.1 47.2,15.3 47.2,14.5 47.2,13.7 47.2,12.9 46.4,12.9 48.7,21.5 49.5,21.5 50.3,22.3 51.1,22.3 47.9,21.5 45.5,23.1 46.3,23.1 47.1,23.1 47.9,23.1 45.5,23.9 46.3,23.9 47.1,23.9 47.9,23.9 48.7,23.9 48.7,23.1 47.9,22.3 48.7,22.3 49.5,23.1 50.3,23.1 51.1,23.1 51.9,23.1 49.5,23.9 50.3,23.9 51.1,23.9 51.9,23.9 52.7,23.9 52.7,23.1 53.5,23.1 54.3,23.1 55.1,23.1 54.3,21.5 53.5,23.9 54.3,23.9 55.1,23.9 54.3,22.3 55.1,22.3 55.1,21.5 52.7,22.3 53.5,22.3 49.5,22.3 51.9,22.3 47.1,22.3 45.5,22.3 46.3,22.3 44.7,22.3 44.7,23.1 43.9,23.1 43.9,23.9 43.9,24.7 47.9,24.7 48.7,24.7 49.5,24.7 50.3,24.7 44.7,23.9 44.7,24.7 45.5,24.7 46.3,24.7 47.1,24.7 51.1,24.7 55.9,21.5 56.7,21.5 57.5,21.5 58.3,21.5 55.9,22.3 56.7,22.3 57.5,22.3 58.3,22.3 59.1,22.3 59.1,21.5 59.9,21.5 60.7,21.5 61.5,21.5 62.3,21.5 59.9,22.3 60.7,22.3 61.5,22.3 62.3,22.3 63.1,22.3 63.1,21.5 43.9,21.5 43.9,22.3 20.8,22.3 21.6,22.3 22.4,22.3 20.8,21.5 21.6,21.5 22.4,21.5 25.8,21.5 26.6,21.5 25.8,22.3 26.6,22.3 27.4,22.3 27.4,21.5 28.2,21.5 29,21.5 29.8,21.5 30.6,21.5 28.2,22.3 29,22.3 29.8,22.3 30.6,22.3 31.4,22.3 31.4,21.5 32.2,21.5 32.2,22.3 33,22.3 33,21.5 33.8,21.5 34.6,21.5 35.4,21.5 36.2,21.5 33.8,22.3 34.6,22.3 35.4,22.3 36.2,22.3 37,22.3 37,21.5 37.8,21.5 38.6,21.5 39.4,21.5 40.2,21.5 37.8,22.3 38.6,22.3 39.4,22.3 40.2,22.3 41,22.3 41,21.5 26.6,23.1 26.6,23.9 27.4,23.9 27.4,23.1 26.6,24.7 27.4,24.7 25.8,24.7 22.4,33.5 21.6,33.5 25.9,32.8 29.8,29.5 29.8,30.3 29,30.3 28.2,30.3 27.4,27.9 27.4,28.7 29,29.5 28.2,29.5 26.6,27.9 26.6,28.7 26.6,29.5 27.4,29.5 27.4,30.3 27.4,27.1 26.6,25.5 26.6,26.3 26.6,30.3 27.4,25.5 25.8,25.5 25.8,26.3 25.8,27.1 26.6,27.1 25.9,32 22.4,32.7 21.6,32.7 21.6,31.9 22.4,31.9 22.4,31.1 21.6,31.1 21.6,30.3 21.6,29.5 21.6,28.7 21.6,27.9 22.4,30.3 22.4,29.5 22.4,28.7 22.4,27.9 22.4,27.1 21.6,27.1 21.6,26.3 21.6,25.5 21.6,24.7 21.6,23.9 22.4,26.3 22.4,25.5 22.4,24.7 22.4,23.9 22.4,23.1 21.6,23.1 25.9,33.6 22.4,34.3 21.6,34.3 25.9,35.2 25.9,34.4 25.9,36 29.8,34.3 29.8,35.1 29,35.1 29,34.3 29.8,35.9 29,35.9 29.8,32.7 29.8,33.5 29,33.5 29,32.7 29.8,31.1 29.8,31.9 29,31.9 29,31.1 30.6,38.3 30.6,39.1 29.8,39.1 30.6,36.7 29.8,38.3 30.6,35.9 29.8,37.5 29.8,36.7 30.6,37.5 30.6,35.1 40.2,76.9 40.2,76.1 41,76.1 41,76.9 40.2,75.3 40.2,74.5 41,74.5 41,75.3 40.2,73.7 40.2,72.9 41,72.9 41,73.7 40.2,72.1 40.2,71.3 41,71.3 41,72.1 45.8,72.1 45.8,71.3 46.6,71.3 46.6,72.1 47.4,72.1 47.4,71.3 48.2,71.3 48.2,72.1 49,72.1 49,71.3 49.8,71.3 49.8,72.1 50.6,72.1 50.6,71.3 51.4,71.3 51.4,72.1 41,30.3 40.2,30.3 46.6,30.3 46.6,29.5 45.8,30.3 45,30.3 45,29.5 45.8,29.5 44.2,30.3 43.4,30.3 43.4,29.5 44.2,29.5 42.6,30.3 41.8,30.3 41.8,29.5 42.6,29.5 41,29.5 40.2,29.5 41,23.1 41,23.9 40.2,23.9 40.2,23.1 41,24.7 41,25.5 40.2,25.5 40.2,24.7 41,26.3 41,27.1 40.2,27.1 40.2,26.3 41,27.9 41,28.7 40.2,28.7 40.2,27.9 50.6,28.7 50.6,27.9 49.8,28.7 49,28.7 49,27.9 49.8,27.9 48.2,28.7 47.4,28.7 47.4,27.9 48.2,27.9 46.6,28.7 45.8,28.7 45.8,27.9 46.6,27.9 51.4,28.7 51.4,27.9 30.6,39.9 30.6,40.7 29.8,40.7 29.8,39.9 32.2,39.9 32.2,40.7 31.4,40.7 31.4,39.9 35.4,39.9 35.4,40.7 34.6,40.7 34.6,39.9 33.8,39.9 33.8,40.7 33,40.7 33,39.9 35.4,39.1 36.2,39.1 36.2,40.7 36.2,39.9 41,39.1 41.8,39.1 41,38.3 41.8,38.3 36.2,37.5 36.2,38.3 35.4,38.3 35.4,37.5 37,36.7 37,37.5 35.4,36.7 36.2,36.7 40.2,36.7 40.2,37.5 39.4,37.5 39.4,36.7 38.6,36.7 38.6,37.5 37.8,37.5 37.8,36.7 41,37.5 41,36.7 41.8,37.5 41.8,36.7 25.9,53.8 25.9,53 25.9,52.2 25.9,51.4 25.9,54.6 25.9,45 25.9,44.2 25.9,46.6 25.9,45.8 26.7,49.8 25.9,49 25.9,48.2 25.9,47.4 25.9,50.6 31.1,44.2 31.1,45 30.3,45 30.3,44.2 29.5,44.2 29.5,45 28.7,45 28.7,44.2 31.1,51.2 31.1,52 30.3,52 30.3,51.2 29.5,51.2 29.5,52 28.7,52 28.7,51.2 29.2,58 29.2,58.8 28.4,58.8 28.4,58 27.6,58 27.6,58.8 32.8,59.6 32,59.6 31.2,59.6 3.4,65 3.4,65.8 2.6,65.8 2.6,65 1.8,65 1.8,65.8 3.4,63.4 3.4,64.2 2.6,64.2 2.6,63.4 1.8,63.4 1.8,64.2 46.8,43.9 46.8,44.7 46,44.7 46,43.9 45.2,43.9 45.2,44.7 28.3,49.8 27.5,49.8 25.9,49.8 35.5,67.9 34.7,67.9 33.9,67.9 30.6,70.5 31.4,70.5 30.6,72.1 31.4,72.1 30.6,71.3 31.4,71.3 32.2,72.1 33,72.1 33.8,72.1 34.6,72.1 32.2,71.3 33,71.3 33.8,71.3 34.6,71.3 35.4,71.3 35.4,72.1 36.2,72.1 37,72.1 37.8,72.1 38.6,72.1 36.2,71.3 37,71.3 37.8,71.3 38.6,71.3 39.4,71.3 39.4,72.1 39.7,61 39.7,61.8 39,58.4 39,59.2 39,60 38.9,61 38.9,61.8 40.2,63.7 40.2,65.6 40.2,67.9 31.2,64.5 30.6,63.9 38.7,48.1 39.8,51.7 37.4,45.1 36.6,45.1 42.8,40.7 42.8,39.9 47.8,41.1 58.8,42.6 58,42.6 57.2,42.6 59.1,66 59.1,65.2 59.9,65.2 59.9,66
  pour Top (rank 6): -2,102 72,102 72,-2 -2,-2
  pour Bottom (rank 6): -4,104 74,104 74,-4 -4,-4
  pour Top (no thermals): 0,32.5 19,32.5 19,7.5 0,7.5
  pour Top (no thermals): 69,16 64,16 64,24 69,24
  pour Bottom (no thermals): 69,16 64,16 64,24 69,24
  pour Top (no thermals): 69,76 64,76 64,84 69,84
  pour Bottom (no thermals): 69,76 64,76 64,84 69,84
  pour Top (no thermals): 0,92.5 19,92.5 19,67.5 0,67.5
I2C0_SCL  (via drill 0.3)
  Top 0.2: U1.19 53.51,64.35 56.86,61 58.1,61 v59.1,60 R46.1 | R5.2 60.78,41.52 v60.6,41.7 | v58.7,44.4 58.1,45 57.76,45 57.33,45.44 57.33,54.43 v58.7,55.8
  Bottom 0.2: v60.6,41.7 59.93,42.37 59.93,42.84 58.7,44.06 v58.7,44.4 | v58.7,55.8 58.7,57.2 59.1,57.6 v59.1,60
I2C0_SDA  (via drill 0.3)
  Top 0.2: U1.18 53.55,63.85 v57.4,60 R45.1 | v57.9,44.4 57,45.3 57,54.9 v57.9,55.8 | R4.2 v59.6,38.6
  Bottom 0.2: v59.6,38.6 59.6,42.7 v57.9,44.4 | v57.9,55.8 57.9,57.2 57.4,57.7 v57.4,60
I2C1_SCL  (via drill 0.3)
  Top 0.2: v57,55.8 56.53,55.33 56.53,44.67 v56.8,44.4 | v54.5,38.2 54.4,38.1 U3.4 | v18,61.1 v18,66.2 | v2.8,61.8 3.1,61.5 U5.2 | U1.17 53.45,63.35 55.7,61.1 v55.7,60 R3.1
  Bottom 0.2: v56.8,44.4 56.53,44.13 56.53,42.33 54.7,40.5 54.7,38.4 v54.5,38.2 | v18,61.1 18.39,61.49 23.95,61.49 25.96,59.47 29.14,59.47 32.63,62.97 39.56,62.97 47.66,54.87 56.07,54.87 v57,55.8 57,56.9 55.7,58.2 v55.7,60 | v18,66.2 17.47,66.73 16.98,66.73 16.51,66.25 9.03,66.25 4.58,61.8 v2.8,61.8
I2C1_SDA  (via drill 0.3)
  Top 0.2: v55.9,44.4 56.2,44.7 v56.2,55.8 | v53.7,38.2 53.9,38 U3.5 | v17.2,61.5 v17.2,66.2 | v2.8,61 U5.3 | U1.16 51.95,62.05 v54,60 R2.1
  Bottom 0.2: v55.9,44.4 56.2,44.1 56.2,42.46 54.37,40.63 54.37,38.87 v53.7,38.2 | v17.2,61.5 17.2,61.52 17.5,61.82 24.08,61.82 26.1,59.8 29,59.8 32.5,63.3 39.7,63.3 47.8,55.2 55.6,55.2 v56.2,55.8 56.2,56.4 54,58.6 v54,60 | v17.2,66.2 16.93,65.93 9.16,65.93 4.24,61 v2.8,61
LED
  Top 0.2: U1.6 46.35,64.35 44.2,62.2 R6.2
N$1
  Top 0.305: R16.2 57.81,31.69 arc45 57.11,31.98 56.5,31.98 arc-90 55.9,32.58 U3.15
N$2
  Top 0.305: U3.17 R15.2
N$3
  Top 0.254: U4.1 8.95,52.25 8.8,52.4 R19.2
N$4
  Top 0.508: CON1.2 63.32,39.5 R5.1
N$5
  Top 0.305: R14.2 U3.12
N$6
  Top 0.305: U1.21 53.75,65.35 54.9,66.5 C4.1
N$7
  Top 0.8: U2.3 51.22,41.2 C27.1 R12.2 54.26,39.52 C28.1
N$8
  Top 0.2: U4.10 12.35,46.42 11.37,45.45 8.93,45.45 7.22,43.74 R22.2
N$9
  Top 0.5: RFCON1.SIGNAL 23.98,20 | 23.98,20 L3.2 | C9.1 23.98,20
N$10
  Top 0.5: C9.2 R7.2
N$11
  Top 0.813: D2.A R29.1
N$12
  Top 0.8: L13.2 C21.1
N$13
  Top 0.813: L3.1 24,23.28 | 24,23.28 C7.1 | L1.2 24,23.28
N$14
  Top 0.8: L5.2 C13.1
N$15
  Top 0.8: C13.2 L9.1 42.52,26.6 44.28,26.6 C17.1 44.32,26.6 L13.1
N$16
  Top 0.8: L14.2 53.72,20 | 53.72,20 C23.1 | C19.2 53.72,20
N$17
  Top 0.8: 31.24,20.02 R7.1 32.92,20 | L7.1 44.28,20 | 42.52,20 L5.1 | 44.28,20 42.52,20 | C11.1 44.28,20 | 42.5,20.02 42.52,20 | 42.52,20 32.92,20 | 32.92,20 R9.2
N$18
  Top 0.8: L7.2 47.72,20 | C11.2 47.72,20 | 47.72,20 47.74,20.02 | 47.72,20 48.98,20 C15.1 50.26,20.02 | 50.26,20.02 L14.1 | C19.1 50.3,20.02 50.26,20.02
N$19
  Top 1.27: F3.2 49.5,53 CON2.P$2
N$20
  Top 0.8: C23.2 RFCON3.SIG
N$22
  Top 0.8: L10.2 C15.2
N$23
  Top 0.813: D3.A R30.1
N$24
  Top 0.5: RFCON2.SIGNAL 23.98,80 | 23.98,80 L4.2 | C10.1 23.98,80
  Top 0.8: RFCON2.SIGNAL 16.73,80.02
N$25
  Top 0.813: R6.1 D1.A
N$26
  Top 0.5: C10.2 R8.2
N$27
  Top 0.813: L4.1 24,76.72 | 24,76.72 C8.1 | L2.2 24,76.72
N$28
  Top 0.8: L15.2 C22.1
N$29
  Top 0.8: L6.2 C14.1
N$30
  Top 0.8: C14.2 L11.1 42.52,73.4 44.28,73.4 C18.1 45.96,73.42 L15.1
N$31
  Top 0.8: R8.1 32.88,80 | 32.88,80 R10.2 | C12.1 44.28,80 | 44.28,80 42.52,80 L6.1 42.48,80 32.88,80 | L8.1 44.28,80
N$32
  Top 0.8: C12.2 47.72,80 | 47.72,80 48.98,80 C16.1 49.02,80 50.28,80 | L8.2 47.72,80 | C20.1 50.28,80 | L16.1 50.28,80
N$33
  Top 0.8: C24.2 RFCON4.SIG
N$34
  Top 0.8: C16.2 L12.2
N$35
  Top 0.8: C20.2 53.72,80 | 53.72,80 C24.1 | L16.2 53.72,80
N$36
  Top 0.305: U3.1 55.9,39.48 C28.2
N$37
  Top 0.305: U3.6 R13.1
N$38
  Top 0.508: CON1.1 62.52,38.5 R4.1
N$149
  Top 0.813: R42.1 D4.A
REF1
  Top 0.8: C21.2 52.9,26.6 arc90 54.4,28.1 R14.1
REF2  (via drill 0.4 pad 0.8)
  Top 0.8: C22.2 v52.1,73.4 | R15.1 v62.6,34.6
  Bottom 0.8: v52.1,73.4 67,73.4 arc-90 68.5,71.9 68.5,36.1 arc-90 67,34.6 v62.6,34.6
SWCLK  (via drill 0.3)
  Top 0.2: U1.25 51.95,68.39 52.8,69.24 v52.8,69.7
  Bottom 0.2: v52.8,69.7 53.05,69.95 55.13,69.95 58.43,66.65 61.35,66.65 63,65 64,65 64.6,65.6 64.6,67.2 TC1.4
  other vias: 63.34,68.47
SWDIO  (via drill 0.3)
  Top 0.2: U1.26 51.45,68.35 51.9,68.8 v51.9,69.9
  Bottom 0.2: 63.2,65.8 TC1.2 62.29,66.97 58.56,66.97 55.27,70.27 52.27,70.27 v51.9,69.9
  other vias: 63.34,65.93
SWO  (via drill 0.3)
  Top 0.2: U1.27 50.95,68.55 51.2,68.8 v51.2,70.6
  Bottom 0.2: v51.2,70.6 55.4,70.6 58.7,67.3 61.2,67.3 62.06,68.17 v62.06,69.74
VBIAS1
  Top 0.813: L1.1 24,28.28 C5.1 C55.1 23.98,32.33 C53.1 C51.1 23.98,35.17 R33.2 | R33.2 23.96,37.42 R29.2 | F1.1 23.98,40.12 R33.2
VBIAS1_BST
  Top 0.254: U4.15 15.25,48.25 16.1,47.4 16.1,44.12 C35.2
VBIAS1_EN  (via drill 0.3)
  Top 0.2: U4.9 11.85,46.39 11.23,45.77 8.69,45.77 8.32,45.4 R17.2 6.42,44.6 v3.1,44.6 | v48.4,69.4 48.95,68.85 U1.31
  Bottom 0.2: v3.1,44.6 2.45,45.25 2.45,57.83 9.57,64.95 27.07,64.95 31.25,69.13 47.13,69.13 47.4,69.4 v48.4,69.4
VBIAS1_FB  (via drill 0.3)
  Top 0.254: U4.27 11.85,53.85 v11.7,54 11.1,54.6 10.3,54.6 9.9,55 R23.1 | v15.6,40.3 16.78,40.3 R26.2
  Top 0.813: R25.1 C38.2 18.4,40.28 R26.2
  Bottom 0.254: v11.7,54 11.7,53.8 10.3,52.4 10.3,45.6 v15.6,40.3
VBIAS1_PG  (via drill 0.3)
  Top 0.2: U4.12 13.35,46.5 11.64,44.79 9.5,44.79 8.95,44.25 8.95,42.89 v8.03,41.96 | v38.6,70.1 R20.1 | v49.4,70.6 49.95,70.05 U1.29
  Bottom 0.2: v8.03,41.96 7.81,42.18 3.82,42.18 1.8,44.2 1.8,58.1 9.3,65.6 26.8,65.6 30.98,69.78 36.08,69.78 36.6,70.3 38.4,70.3 v38.6,70.1 38.92,69.78 46.86,69.78 47.67,70.6 v49.4,70.6
VBIAS1_SS
  Top 0.254: U4.26 12.35,54.95 11.7,55.6 C32.1
VBIAS1_SW
  Top 0.813: C35.1 17.42,47.27 L17.1
  pour Top (no thermals): 14.28,49.25 18.4,49.25 18.4,45.5 16.5,45.5 16.5,47.6 15.35,48.75 14.28,48.75
VBIAS1_UNFUSED
  Top 0.813: C38.1 R25.2
  pour Top (no thermals): 19.7,49.2 24.9,49.2 24.9,44.3 26.7,42.5 26.7,41.4 19.7,41.4
VBIAS1_VADJ
  Top 0.305: U5.6 9.5,60 9.9,59.6 R23.2
VBIAS1_VSENSE  (via drill 0.3)
  Top 0.254: C65.1 43.8,67.3 v44.1,67 44.75,66.35 U1.2 | v25.6,38.6 25.62,38.58 R33.1
  Top 0.813: R33.1 R34.2
  Bottom 0.254: v44.1,67 43.88,66.78 32.04,66.78 28.56,63.3 10.8,63.3 7.1,59.6 7.1,46 15.7,37.4 24.4,37.4 v25.6,38.6
VBIAS2
  Top 0.813: L2.1 23.98,73.36 C6.1 C56.1 23.98,67.67 C54.1 C52.1 23.98,64.83 R38.2 | F2.1 23.98,59.38 R38.2 | R30.2 22.02,62.6 R38.2
VBIAS2_BST
  Top 0.254: U4.20 15.25,51.25 16.1,52.1 16.1,55.58 15.98,55.7 C36.2
VBIAS2_EN  (via drill 0.3)
  Top 0.2: U4.8 11.35,46.35 11.1,46.1 9.22,46.1 8.22,47.1 R18.2 6.42,46.3 v3.1,46.3 | v47.9,68.8 48.45,68.25 U1.32
  Bottom 0.2: v3.1,46.3 2.78,46.62 2.78,57.69 9.71,64.62 27.21,64.62 31.39,68.8 v47.9,68.8
VBIAS2_FB
  Top 0.254: U4.24 13.35,54.25 14.65,55.55 14.65,58.05 15.82,59.22 R28.2
  Top 0.305: R24.1 15.42,60.6 R28.2
  Top 0.813: R27.1 C39.2 18.4,59.22 R28.2
VBIAS2_PG  (via drill 0.3)
  Top 0.2: U4.11 12.85,46.46 11.51,45.12 9.36,45.12 8.63,44.38 8.63,43.31 v8.01,42.69 | v36.9,69.7 R21.1 | U1.30 49.45,69.45 v48.9,70
  Bottom 0.2: v8.01,42.69 7.83,42.51 3.96,42.51 2.13,44.34 2.13,57.97 9.44,65.27 26.93,65.27 31.12,69.45 36.65,69.45 v36.9,69.7 37.15,69.45 46.99,69.45 47.54,70 v48.9,70
VBIAS2_SS
  Top 0.254: U4.25 12.85,54.95 13.5,55.6 C33.1
VBIAS2_SW
  Top 0.813: C36.1 17.42,52.23 L18.1
  pour Top (no thermals): 14.28,50.75 15.35,50.75 16.5,51.9 16.5,54 18.4,54 18.4,50.25 14.28,50.25
VBIAS2_UNFUSED
  Top 0.813: C39.1 R27.2
  pour Top (no thermals): 19.7,50.3 24.9,50.3 24.9,55.2 26.7,57 26.7,58.1 19.7,58.1
VBIAS2_VADJ
  Top 0.305: U5.7 11.68,60.5 R24.2
VBIAS2_VSENSE  (via drill 0.3)
  Top 0.254: C69.1 v44,65.6 44.25,65.85 U1.3 | v27.3,61.5 27.28,61.52 R39.2
  Top 0.813: R38.1 R39.2
  Bottom 0.254: v44,65.6 43.2,66.4 32.2,66.4 v27.3,61.5
VBIAS_VCC  (via drill 0.3)
  Top 0.254: U4.28 11.35,53.45 11,53.8 v10.3,53.8 8.8,53.8 8.5,54.1 C31.1 | U4.23 13.85,53.95 14.6,54.7 v15.5,54.7 15.7,54.5 15.7,52.3 15.15,51.75 U4.21 | U4.13 13.85,46.3 14.25,45.9 15.1,45.9 15.5,46.3 v15.5,47.1
  Bottom 0.254: v10.3,53.8 10.2,53.9 11.3,55 12.1,55 14.4,52.7 15.7,52.7 | v15.5,54.7 15.7,54.5 15.7,52.7 | v15.5,47.1 15.7,47.3 15.7,52.7
VIN  (via drill 0.3, 0.5 pad 0.9)
  Top 0.2: U7.14 32.25,47.75 31.9,48.1 C57.1
  Top 0.254: U7.11 32.25,49.25 v32,49 | v37.8,49 37.55,49.25 U7.6
  Top 0.508: v37.8,49 38.6,49 39.6,50 D5.C | C57.1 31.12,48.12 v32,49 32,49.02 C61.1
  Top 0.8: F3.1 v40,53
  Top 0.813: C62.1 41.68,46.97 C75.1 | F3.1 41.73,53.95 R31.2
  Top 1.27: C75.1 41.65,49.55 D5.C 41.73,50.53 F3.1
  Bottom 0.508: v32,49 33.2,50.2 36.6,50.2 v37.8,49
  Bottom 0.8: v40,53 40,54.1 37.7,56.4 11,56.4 9,54.4 v9,49.75
  pour Top (no thermals): 10.92,48.75 9.55,48.75 9.1,48.3 6.8,48.3 6.8,51.2 9.1,51.2 9.55,50.75 10.92,50.75
VIN_VSENSE  (via drill 0.3)
  Top 0.254: U1.13 50.45,60.95 v49.35,59.85 48.9,59.4 C59.1 | R32.2 44.62,58.12 v45.5,59
  Top 0.813: R31.1 R32.2
  Bottom 0.254: v45.5,59 48.5,59 v49.35,59.85

## Text on the board
tPlace: IcyRadio LNB controller v2 / Sep 2020 | LNB 2 | IF 2 / OUT | DC IN / Max. 24 V | + | - | REF / IN | REF / OUT | IF 1 / OUT | LNB 1